# EAGLE design Qwiic_Scale (EAGLE 9.3.0)
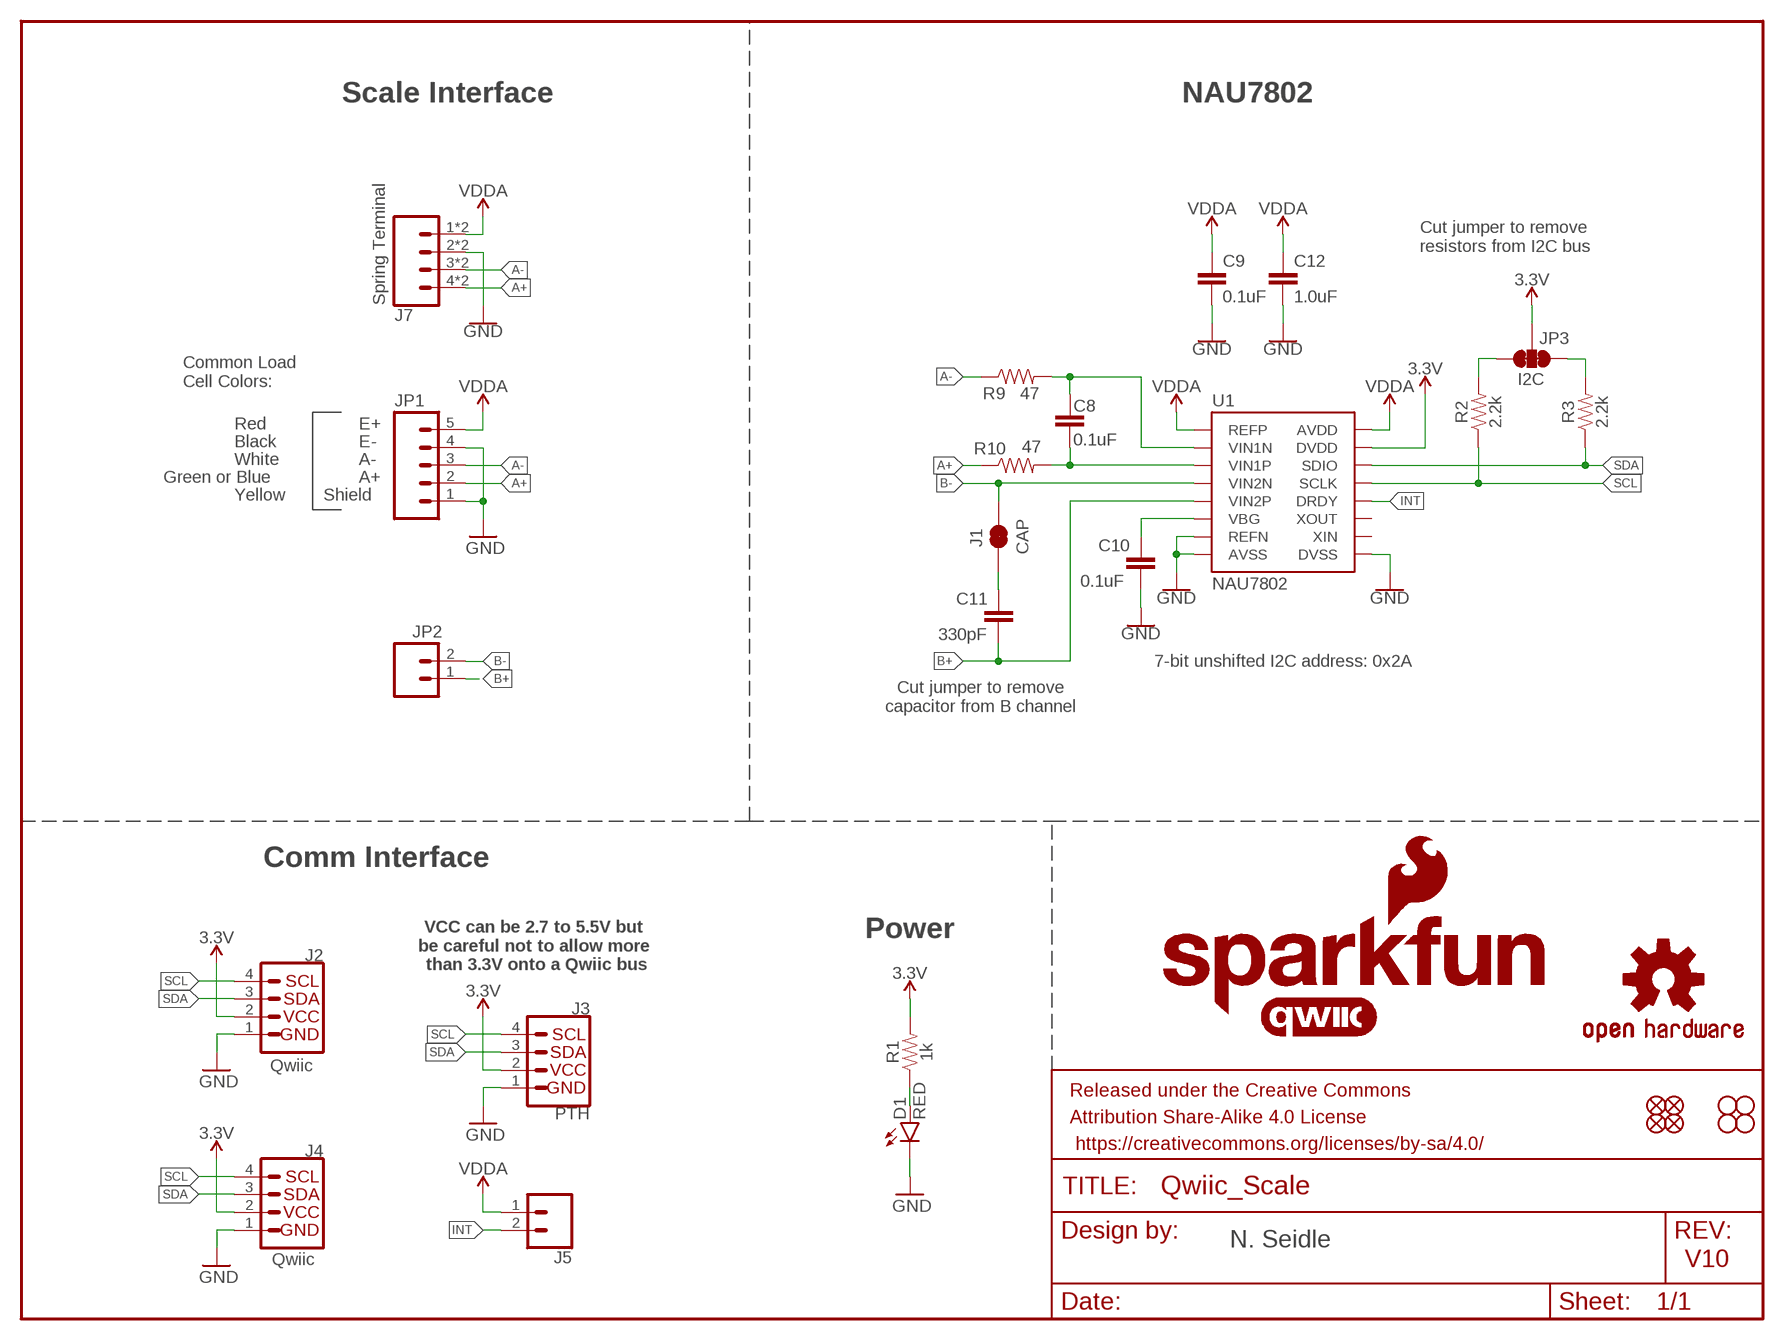
[diagram p0: schematic, sheet 1]

## Parts
C8  0.1uF  0.1UF-0603-25V-(+80/-20%)  [0603]
C9  0.1uF  0.1UF-0603-25V-(+80/-20%)  [0603]
C10  0.1uF  0.1UF-0603-25V-(+80/-20%)  [0603]
C11  330pF  330PF-0603-50V-5%  [0603]
C12  1.0uF  1.0UF-0603-16V-10%  [0603]
D1  RED  LED-RED0603  [LED-0603]
FRAME1  FRAME-LETTER  [CREATIVE_COMMONS]
J1  CAP  JUMPER-SMT_2_NC_TRACE_SILK  [SMT-JUMPER_2_NC_TRACE_SILK]
J2  Qwiic  I2C_STANDARDQWIIC  [JST04_1MM_RA]
J3  PTH  I2C_STANDARD_NO_SILK  [1X04_NO_SILK]
J4  Qwiic  I2C_STANDARDQWIIC  [JST04_1MM_RA]
J5  CONN_021X02_NO_SILK  [1X02_NO_SILK]
J7  Spring Terminal  CONN_04SPRING  [1X04_SPRING_TERMINAL]
JP1  CONN_05NO_SILK  [1X05_NO_SILK]
JP2  CONN_021X02_NO_SILK  [1X02_NO_SILK]
JP3  I2C  JUMPER-SMT_3_2-NC_TRACE_SILK  [SMT-JUMPER_3_2-NC_TRACE_SILK]
JP21  FIDUCIALUFIDUCIAL  [MICRO-FIDUCIAL]
JP31  STAND-OFF  [STAND-OFF]
JP41  STAND-OFF  [STAND-OFF]
JP61  FIDUCIALUFIDUCIAL  [MICRO-FIDUCIAL]
JP71  FIDUCIALUFIDUCIAL  [MICRO-FIDUCIAL]
JP81  FIDUCIALUFIDUCIAL  [MICRO-FIDUCIAL]
JP91  STAND-OFF  [STAND-OFF]
JP101  STAND-OFF  [STAND-OFF]
LOGO1  OSHW-LOGOMINI  [OSHW-LOGO-MINI]
LOGO2  SFE_LOGO_NAME_FLAME.1_INCH  [SFE_LOGO_NAME_FLAME_.1]
R1  1k  1KOHM-0603-1/10W-1%  [0603]
R2  2.2k  2.2KOHM-0603-1/10W-1%  [0603]
R3  2.2k  2.2KOHM-0603-1/10W-1%  [0603]
R9  47  47OHM-0603-1/10W-1%  [0603]
R10  47  47OHM-0603-1/10W-1%  [0603]
U1  NAU7802  NAU7802SOIC  [SO16]
U$16  QWIIC_LOGO_7MM  [QWIIC_7MM]

## Nets
3.3V [3.3V]: J2.2 J3.2 J4.2 JP3.2 R1.2 U1.15(DVDD)
A+: J7.4 J7.8 JP1.2 R10.1
A-: J7.3 J7.7 JP1.3 R9.1
B+: C11.2 JP2.1 U1.5(VIN2P)
B-: J1.2 JP2.2 U1.4(VIN2N)
GND: C9.2 C10.2 C12.2 D1.C J2.1 J3.1 J4.1 J7.2 J7.6 JP1.1 JP1.4 U1.7(REFN) U1.8(AVSS) U1.9(DVSS)
INT: J5.2 U1.12(DRDY)
N$1: C11.1 J1.1
N$2: JP3.1 R3.2
N$3: JP3.3 R2.2
N$10: D1.A R1.1
N$11: C10.1 U1.6(VBG)
N$15: C8.2 R10.2 U1.3(VIN1P)
N$16: C8.1 R9.2 U1.2(VIN1N)
SCL: J2.4 J3.4 J4.4 R2.1 U1.13(SCLK)
SDA: J2.3 J3.3 J4.3 R3.1 U1.14(SDIO)
VDDA: C9.1 C12.1 J5.1 J7.1 J7.5 JP1.5 U1.1(REFP) U1.16(AVDD)
Unconnected: U1.10(XIN) U1.11(XOUT)

## Notes on the sheet
- Scale Interface | NAU7802
- Cut jumper to remove
  resistors from I2C bus
- Common Load
  Cell Colors:
- Red | E+
- Black | E-
- White | A-
- Green or Blue | A+
- Yellow | Shield
- 7-bit unshifted I2C address: 0x2A
- Cut jumper to remove
  capacitor from B channel
- Comm Interface
- Power
- VCC can be 2.7 to 5.5V but 
  be careful not to allow more 
  than 3.3V onto a Qwiic bus
- N. Seidle
- V10

## Library data of the parts
C8-C10 = SparkFun-Capacitors:0.1UF: 0.1µF ceramic capacitors A capacitor is a passive two-terminal electrical component used to store electrical energy temporarily in an electric field.; PROD_ID: CAP-00810
C11 = SparkFun-Capacitors:330PF: 330pF/0.33nF ceramic capacitors A capacitor is a passive two-terminal electrical component used to store electrical energy temporarily in an electric field.; PROD_ID: CAP-10108
C12 = SparkFun-Capacitors:1.0UF: 1µF ceramic capacitors A capacitor is a passive two-terminal electrical component used to store electrical energy temporarily in an electric field.; PROD_ID: CAP-00868
D1 = SparkFun-LED:LED-RED: Red SMD LED Used in manufacturing of most products at SparkFun Packages: 0603 - SMD 0603 package [Product Link] <http://docs.avagotech.com/docs/AV02-0551EN> 0603 SMART - SMD 0603 SMART package ( more efficient and expensive)[Product Link] <http://www.osram-os.com/Graphics/XPic2/00077099_0.pdf> 1206 - SMD1206 package [Product Link] <https://www.sparkfun.com/datasheets/DevTools/LilyPad/Q150OVS4.pdff> SparkFun Products: Pro Mini 328 -5V <https://www.sparkfun.com/products/821> RedBoard <https://www.sparkfun.com/products/12757> IOIO-OTG <https://www.sparkfun.com/products/13613>; PROD_ID: DIO-00819
FRAME1 = SparkFun-Aesthetics:FRAME-LETTER: Schematic Frame - Letter Standard 8.5x11 US Letter frame
J1 = SparkFun-Jumpers:JUMPER-SMT_2_NC_TRACE: Normally closed trace jumper This jumper has a trace between two pads so it's normally closed (NC). Use a razor knife to open the connection. For best results follow the IPC guidelines for cutting traces: Cutout at least 0.063 mm (0.005 in). Remove all loose material to clean up the cut area. Seal the cut with an approved epoxy. Reapply solder to reclose the connection.
J2 J4 = SparkFun-Connectors:I2C_STANDARD: SparkFun I2C Standard Pinout Header SparkFun has standardized on a pinout for all I2C based sensor breakouts. This pinout allows I2C boards to be plugged directly into the headers on Arduino Uno compatible boards, and to be daisy chained easily. Example SparkFun Products: SparkFun Atmospheric Sensor Breakout - BME280 <https://www.sparkfun.com/products/13676> SparkFun Altitude/Pressure Sensor Breakout - MPL3115A2 <https://www.sparkfun.com/products/11084> SparkFun TOF Range Finder Sensor - VL6180 <https://www.sparkfun.com/products/12785>; PROD_ID: CONN-13694; VALUE: Qwiic Right Angle
J3 = SparkFun-Connectors:I2C_STANDARD: SparkFun I2C Standard Pinout Header SparkFun has standardized on a pinout for all I2C based sensor breakouts. This pinout allows I2C boards to be plugged directly into the headers on Arduino Uno compatible boards, and to be daisy chained easily. Example SparkFun Products: SparkFun Atmospheric Sensor Breakout - BME280 <https://www.sparkfun.com/products/13676> SparkFun Altitude/Pressure Sensor Breakout - MPL3115A2 <https://www.sparkfun.com/products/11084> SparkFun TOF Range Finder Sensor - VL6180 <https://www.sparkfun.com/products/12785>
J5 JP2 = SparkFun-Connectors:CONN_02: Multi connection point. Often used as Generic Header-pin footprint for 0.1 inch spaced/style header connections On any of the 0.1 inch spaced packages, you can populate with these: Break Away Headers - Straight <https://www.sparkfun.com/products/116> (PRT-00116) Break Away Male Headers - Right Angle <https://www.sparkfun.com/products/553> (PRT-00553) Female Headers <https://www.sparkfun.com/products/115> (PRT-00115) Break Away Headers - Machine Pin <https://www.sparkfun.com/products/117> (PRT-00117) Break Away Female Headers - Swiss Machine Pin <https://www.sparkfun.com/products/743> (PRT-00743) For SCREWTERMINALS and SPRING TERMINALS visit here: Screw Terimnals on SparkFun.com <https://www.sparkfun.com/search/results?term=Screw+Terminals> (5mm/3.5mm/2.54mm spacing) This device is also useful as a general connection point to wire up your design to another part of your project. Our various solder wires solder well into these plated through hole pads. Hook-Up Wire - Assortment (Stranded, 22 AWG) <https://www.sparkfun.com/products/11375> (PRT-11375) Hook-Up Wire - Assortment (Solid Core, 22 AWG) <https://www.sparkfun.com/products/11367> (PRT-11367) View the entire wire category on our website here <https://www.sparkfun.com/categories/141> Special notes: Molex polarized connector foot print use with: PRT-08233 with associated crimp pins and housings. 2.54_SCREWTERM for use with PRT-10571. 3.5mm Screw Terminal footprints for PRT-08084 5mm Screw Terminal footprints for use with PRT-08432
J7 = SparkFun-Connectors:CONN_04: Multi connection point. Often used as Generic Header-pin footprint for 0.1 inch spaced/style header connections On any of the 0.1 inch spaced packages, you can populate with these: Break Away Headers - Straight <https://www.sparkfun.com/products/116> (PRT-00116) Break Away Male Headers - Right Angle <https://www.sparkfun.com/products/553> (PRT-00553) Female Headers <https://www.sparkfun.com/products/115> (PRT-00115) Break Away Headers - Machine Pin <https://www.sparkfun.com/products/117> (PRT-00117) Break Away Female Headers - Swiss Machine Pin <https://www.sparkfun.com/products/743> (PRT-00743) For SCREWTERMINALS and SPRING TERMINALS visit here: Screw Terimnals on SparkFun.com <https://www.sparkfun.com/search/results?term=Screw+Terminals> (5mm/3.5mm/2.54mm spacing) This device is also useful as a general connection point to wire up your design to another part of your project. Our various solder wires solder well into these plated through hole pads. Hook-Up Wire - Assortment (Stranded, 22 AWG) <https://www.sparkfun.com/products/11375> (PRT-11375) Hook-Up Wire - Assortment (Solid Core, 22 AWG) <https://www.sparkfun.com/products/11367> (PRT-11367) View the entire wire category on our website here <https://www.sparkfun.com/categories/141> Special notes: Molex polarized connector foot print use with SKU : PRT-08231 with associated crimp pins and housings. 1MM SMD Version SKU: PRT-10208; SF_ID: PRT-08075
JP1 = SparkFun-Connectors:CONN_05: Multi connection point. Often used as Generic Header-pin footprint for 0.1 inch spaced/style header connections On any of the 0.1 inch spaced packages, you can populate with these: Break Away Headers - Straight <https://www.sparkfun.com/products/116> (PRT-00116) Break Away Male Headers - Right Angle <https://www.sparkfun.com/products/553> (PRT-00553) Female Headers <https://www.sparkfun.com/products/115> (PRT-00115) Break Away Headers - Machine Pin <https://www.sparkfun.com/products/117> (PRT-00117) Break Away Female Headers - Swiss Machine Pin <https://www.sparkfun.com/products/743> (PRT-00743) For SCREWTERMINALS and SPRING TERMINALS visit here: Screw Terimnals on SparkFun.com <https://www.sparkfun.com/search/results?term=Screw+Terminals> (5mm/3.5mm/2.54mm spacing) This device is also useful as a general connection point to wire up your design to another part of your project. Our various solder wires solder well into these plated through hole pads. Hook-Up Wire - Assortment (Stranded, 22 AWG) <https://www.sparkfun.com/products/11375> (PRT-11375) Hook-Up Wire - Assortment (Solid Core, 22 AWG) <https://www.sparkfun.com/products/11367> (PRT-11367) View the entire wire category on our website here <https://www.sparkfun.com/categories/141> Special notes: Molex polarized connector foot print use with SKU : PRT-08231 with associated crimp pins and housings. 1MM SMD Version SKU: PRT-10208
JP3 = SparkFun-Jumpers:JUMPER-SMT_3_2-NC_TRACE: Normally closed trace jumper (2 of 2 connections) This jumper has a trace between all three pads so they are normally closed (NC). Use a razor knife to open the connection(s). For best results follow the IPC guidelines for cutting traces: Cutout at least 0.063 mm (0.005 in). Remove all loose material to clean up the cut area. Seal the cut with an approved epoxy. Reapply solder to reclose the connection(s).
JP21 JP61 JP71 JP81 = SparkFun:FIDUCIAL: Fiducial Alignment Points Various fiducial points for machine vision alignment.
JP31 JP41 JP91 JP101 = SparkFun:STAND-OFF: Stand Off This is the mechanical footprint for a #4 phillips button head screw. Use the keepout ring to avoid running the screw head into surrounding components. SKU : PRT-00447
LOGO1 = SparkFun-Aesthetics:OSHW-LOGO: Open-Source Hardware (OSHW) Logo This logo indicates the piece of hardware it is found on incorporates a OSHW license and/or adheres to the definition of open source hardware found here: http://freedomdefined.org/OSHW
LOGO2 = SparkFun-Aesthetics:SFE_LOGO_NAME_FLAME: SparkFun Font Logo w/ Flame This is the SparkFun full logo. The logo on the schematic will always be the same size; the package variant is the height of the flame part of the logo. Default layer for the logo on the board is tSilk.
R1 = SparkFun-Resistors:1KOHM: 1kΩ resistor A resistor is a passive two-terminal electrical component that implements electrical resistance as a circuit element. Resistors act to reduce current flow, and, at the same time, act to lower voltage levels within circuits. - Wikipedia; PROD_ID: RES-07856
R2 R3 = SparkFun-Resistors:2.2KOHM: 2.2kΩ resistor A resistor is a passive two-terminal electrical component that implements electrical resistance as a circuit element. Resistors act to reduce current flow, and, at the same time, act to lower voltage levels within circuits. - Wikipedia; PROD_ID: RES-08272
R9 R10 = SparkFun-Resistors:47OHM: 47Ω resistor A resistor is a passive two-terminal electrical component that implements electrical resistance as a circuit element. Resistors act to reduce current flow, and, at the same time, act to lower voltage levels within circuits. - Wikipedia; PROD_ID: RES-14282
U1 = SparkFun-IC-Conversion:NAU7802: 24-bit load cell conversion IC with I2C interface in SOIC-16 package. Similar to HX711 but with true I2C interface.; PROD_ID: IC-14299
U$16 = SparkFun-Aesthetics:QWIIC_LOGO: Qwiic Logos for placement on schematic and PCB. The 5.5mm silk logo is best for placing next to Qwiic connector.

## Net classes
1 power: width 0.178 mm
2 3.3V: width 0.508 mm

## Board
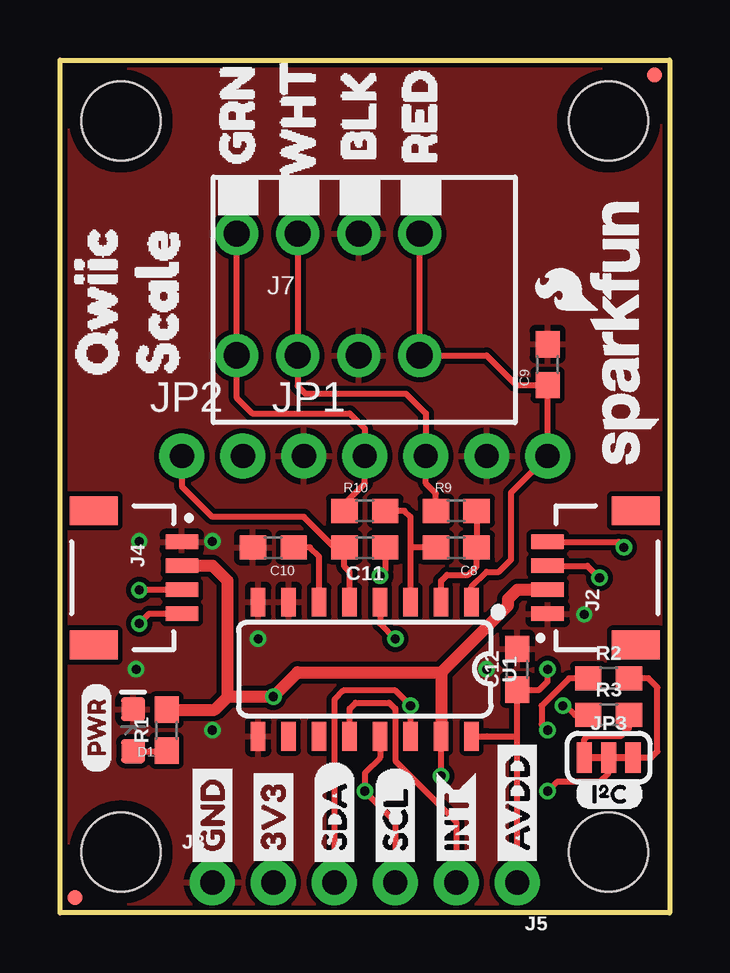
[diagram p1: board, top side]
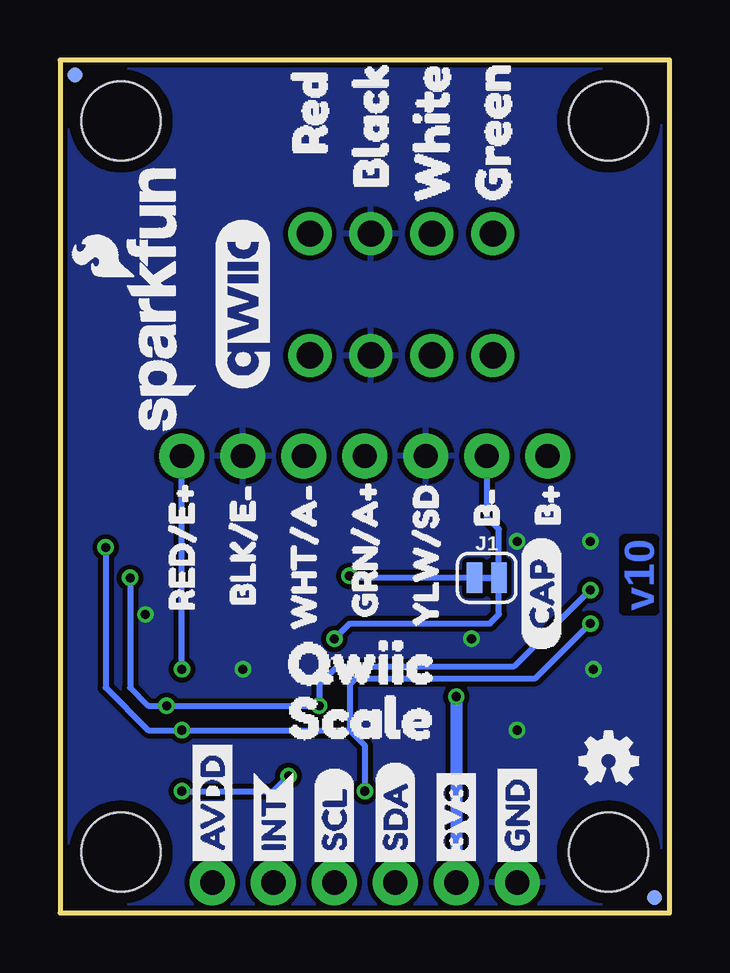
[diagram p2: board, bottom side, seen from below]

Size 25.4 x 35.56 mm. Coordinates in mm from the lower left corner, seen from the top.
Outline: 25.4,0 0,0 0,35.56 25.4,35.56 25.4,0
Copper layers (1*16): Top 0.035mm / dielectric 1.5mm / Bottom 0.035mm
Design rules "SparkFun-2-layer-PCBWay-LIMIT": minimum track width 6mil, minimum drill 0.3mm, track to track 6mil, track to pad 6mil, pad to pad 6mil, via to via 6mil, smd to smd 6mil, copper to edge 6mil, drill to drill 6mil, minimum pad ring 6mil, minimum via ring 6mil, stop-mask expansion 4mil, vias tented up to drill 25mil, thermal gap 10mil

### Footprints (pad centres in the part's own frame; a part is rotated, then mirrored left to right if it is on the bottom)
0603 = smd 1.1 x 1: 1 -0.85,0; 2 0.85,0
LED-0603 = smd 1 x 1: A -0.877,0; C 0.877,0
SMT-JUMPER_2_NC_TRACE_SILK = smd 0.635 x 1.27: 1 -0.508,0; 2 0.508,0
JST04_1MM_RA = smd 0.6 x 1.35: 1 -1.5,0; 2 -0.5,0; 3 0.5,0; 4 1.5,0 | smd 1.2 x 2: NC1 2.8,-3.675; NC2 -2.8,-3.675
1X04_NO_SILK = drill 1.016 pad 1.88: 1 0,0; 2 2.54,0; 3 5.08,0; 4 7.62,0
1X02_NO_SILK = drill 1.016 pad 1.88: 1 0,0; 2 2.54,0
1X04_SPRING_TERMINAL = drill 1.1 pad 1.8: 1 7.62,2.54; 2 5.08,2.54; 3 2.54,2.54; 4 0,2.54; 5 7.62,-2.54; 6 5.08,-2.54; 7 2.54,-2.54; 8 0,-2.54
1X05_NO_SILK = drill 1.016 pad 1.88: 1 0,0; 2 2.54,0; 3 5.08,0; 4 7.62,0; 5 10.16,0
SMT-JUMPER_3_2-NC_TRACE_SILK = smd 0.635 x 1.27: 1 -1.016,0; 2 0,0; 3 1.016,0
MICRO-FIDUCIAL = smd 0.635 x 0.635: 1 0,0
STAND-OFF = hole 3.302: 0,0
SO16 = smd 0.6 x 1.2: 1 -4.445,-2.8; 2 -3.175,-2.8; 3 -1.905,-2.8; 4 -0.635,-2.8; 5 0.635,-2.8; 6 1.905,-2.8; 7 3.175,-2.8; 8 4.445,-2.8; 9 4.445,2.8; 10 3.175,2.8; 11 1.905,2.8; 12 0.635,2.8; 13 -0.635,2.8; 14 -1.905,2.8; 15 -3.175,2.8; 16 -4.445,2.8

### Placement (x,y rotation side)
C8  16.51,15.24 180 top
C9  20.32,22.86 90 top
C10  8.89,15.24 180 top
C11  12.7,15.24 180 top
C12  19.05,10.16 90 top
D1  3.05,7.62 90 top
FRAME1  -17.78,-17.78 0 top  (outside the outline)
J1  7.62,13.97 0 bottom
J2  20.32,13.97 90 top
J3  6.35,1.27 0 top
J4  5.08,13.97 270 top
J5  19.05,1.27 180 top
J7  7.37,25.78 0 top
JP1  10.16,19.05 0 top
JP2  5.08,19.05 0 top
JP3  22.86,6.48 0 top
JP21  24.77,34.92 90 top
JP31  2.54,2.54 90 top
JP41  2.54,33.02 90 top
JP61  0.64,0.64 90 top
JP71  24.77,34.92 270 bottom
JP81  0.64,0.64 270 bottom
JP91  22.86,2.54 90 top
JP101  22.86,33.02 90 top
LOGO1  2.54,6.35 0 bottom
LOGO2  21.21,25.65 90 bottom
LOGO3  SFE_LOGO_NAME_FLAME.1_INCH  [SFE_LOGO_NAME_FLAME_.1]  23.5,24.26 90 top
R1  4.45,7.62 90 top
R2  22.86,9.78 0 top
R3  22.86,8.26 0 top
R9  16.51,16.76 0 top
R10  12.7,16.76 0 top
U1  12.7,10.16 180 top
U$1  [SDA-[)]  11.43,1.65 90 top
U$3  [SCL-[)]  13.97,1.65 90 top
U$4  [SDA-[)]  11.43,1.65 90 bottom
U$5  [SCL-[)]  13.97,1.65 90 bottom
U$6  [3V3-04]  8.89,1.65 90 top
U$7  [3V3-04]  8.89,1.65 90 bottom
U$8  [GND-04]  6.35,1.65 90 top
U$9  [GND-04]  6.35,1.65 90 bottom
U$11  [YLW#SD4]  10.16,11.05 90 bottom
U$12  [B#11]  7.62,15.24 90 bottom
U$13  [B#12]  5.08,15.24 90 bottom
U$14  [QWIIC2]  17.4,10.41 0 bottom
U$15  [INT0]  16.51,1.65 90 bottom
U$16  17.78,25.4 90 bottom
U$17  [SCALE3]  17.4,8.13 0 bottom
U$18  [PWR-()-03]  1.52,5.84 90 top
U$19  [I_SUPER2_C-()-03]  21.46,4.95 0 top
U$20  [CAP0]  5.33,10.92 90 bottom
U$21  [INT0]  16.51,1.65 90 top
U$22  [QWIIC2]  1.52,20.95 90 top
U$24  [SCALE3]  4.06,20.95 90 top
U$34  [BLK#E#1]  17.78,11.94 90 bottom
U$35  [GRN#A#4]  12.7,11.43 90 bottom
U$36  [AVDD4]  19.05,1.65 90 top
U$37  [BLACK5]  12.45,28.96 90 bottom
U$38  [BLK1]  12.45,30.1 90 top
U$39  [GREEN7]  7.37,28.45 90 bottom
U$40  [GRN3]  7.37,29.97 90 top
U$41  [RED0]  14.99,29.97 90 top
U$42  [RED4]  14.99,30.35 90 bottom
U$43  [WHITE6]  9.91,28.19 90 bottom
U$44  [WHT2]  9.91,29.46 90 top
U$45  [AVDD4]  19.05,1.65 90 bottom
U$46  [RED#E#2]  20.32,11.68 90 bottom
U$48  [WHT#A#3]  15.24,10.92 90 bottom

### Tracks (layer width: path | path; a pad name or v marks a point on that pad's centre or on a via)
3.3V  (via drill 0.38)
  Top 0.254: JP3.2 22.86,5.84 22.48,5.46 20.7,5.46 v20.32,5.08 | v15.88,5.71 U1.15
  Top 0.508: 6.99,9.02 6.99,13.84 6.36,14.47 J4.2 | J2.2 19.06,13.47 18.67,13.08 18.67,12.83 15.88,10.03 | 15.88,10.03 U1.15 | 6.99,9.02 v8.89,9.02 9.91,10.03 15.88,10.03 | 6.99,9.02 6.44,8.47 R1.2
  Bottom 0.254: v20.32,5.08 16.51,5.08 v15.88,5.71
  Bottom 0.508: v8.89,9.02 J3.2
A+
  Top 0.254: R10.1 11.85,17.06 12.7,17.91 JP1.2 12.7,20.19 12.06,20.83 8,20.83 7.37,21.46 J7.8 J7.4
A-
  Top 0.254: J7.3 J7.7 9.91,21.97 10.22,21.65 14.41,21.65 15.24,20.83 JP1.3 15.24,17.91 15.66,17.49 R9.1
B+
  Top 0.254: U1.5 12.06,14.22 11.85,14.44 C11.2 11.43,15.24 10.16,16.51 6.35,16.51 5.08,17.78 JP2.1
B-  (via drill 0.38)
  Top 0.254: U1.4 13.34,12.06 v13.97,11.43
  Bottom 0.254: v13.97,11.43 13.34,12.06 7.49,12.06 7.11,12.45 J1.2 7.11,16 7.62,16.51 JP2.2
GND  (via drill 0.38)
  other vias: 17.78,10.16 6.35,7.62 3.17,10.16 3.3,15.49 21.84,12.45 6.35,15.49 8.26,11.43
  pour Top (isolate 0.203, rank 4): 0,0 0,35.56 25.4,35.56 25.4,0
  pour Bottom (isolate 0.203, rank 4): 0,0 0,35.56 25.4,35.56 25.4,0
INT
  Top 0.254: U1.12 12.06,8.51 12.32,8.76 13.72,8.76 13.97,8.51 13.97,6.35 16.51,3.81 J5.2
N$1  (via drill 0.38)
  Top 0.254: C11.1 13.55,14.27 v13.34,14.05
  Bottom 0.254: v13.34,14.05 13.25,13.97 J1.1
N$2
  Top 0.254: JP3.1 21.84,7.24 22,7.39 23.39,7.39 23.71,7.71 R3.2
N$3
  Top 0.254: JP3.3 24.64,6.48 24.89,6.73 24.89,9.4 24.51,9.78 R2.2
N$10
  Top 0.254: D1.A 4.42,6.74 R1.1
N$11
  Top 0.254: U1.6 10.79,14.86 10.41,15.24 C10.1
N$15
  Top 0.254: U1.3 14.61,15.24 | 14.61,15.24 14.61,16.51 14.35,16.76 R10.2 | C8.2 14.61,15.24
N$16
  Top 0.254: R9.2 C8.1 17.36,14.44 17.02,14.1 16.13,14.1 15.88,13.84 U1.2
SCL  (via drill 0.38)
  Top 0.254: U1.13 13.34,6.47 12.7,5.84 v12.7,5.08 13.97,3.81 J3.4 | J2.4 23.27,15.47 v23.5,15.24 | J4.4 3.71,12.47 v3.3,12.06 | R2.1 21.21,9.78 20.07,8.64 20.07,7.87 v20.32,7.62
  Bottom 0.254: v23.5,15.24 23.5,9.4 21.72,7.62 v20.32,7.62 13.34,7.62 | v3.3,12.06 5.59,9.78 13.08,9.78 13.34,9.53 13.34,7.62 | 13.34,7.62 12.7,6.99 v12.7,5.08
SDA  (via drill 0.38)
  Top 0.254: U1.14 v14.61,8.64 13.97,9.27 11.81,9.27 11.43,8.89 J3.3 | J2.3 21.98,14.47 v22.48,13.97 | J4.3 v3.31,13.47 v3.3,13.46 | R3.1 21.46,8.26 21.08,8.64 v20.95,8.64
  Bottom 0.254: v22.48,13.97 22.48,9.4 21.72,8.64 v20.95,8.64 v14.61,8.64 14.61,9.53 13.84,10.29 6.48,10.29 v3.3,13.46
VDDA  (via drill 0.38)
  Top 0.254: U1.16 17.78,7.36 17.79,7.37 19.05,7.37 | U1.1 17.14,13.59 17.78,14.22 18.29,14.22 18.8,14.73 18.8,17.53 JP1.5 C9.1 19.01,22.01 17.78,23.24 J7.5 J7.1 | J5.1 19.05,7.37 | 19.05,7.37 C12.1 19.98,9.31 20.32,9.65 v20.32,10.16
  Bottom 0.254: v20.32,10.16 JP1.5

### Text on the board
Bottom: v10
Measures: Units in inches
tDocu: N. Seidle